# Altium schematic sheet [04] Connector.SchDoc
size A4
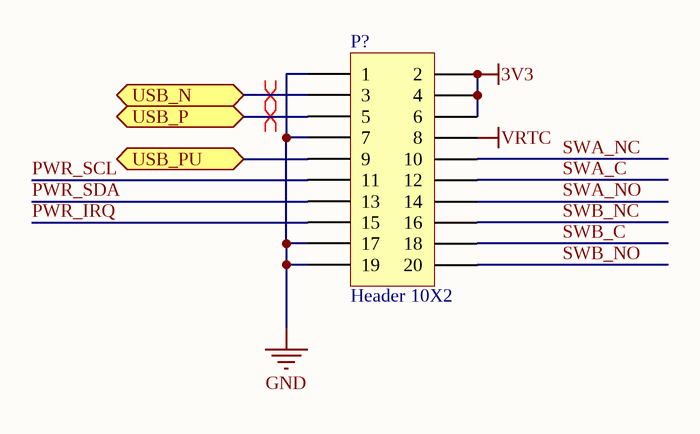
[diagram p0: [04] Connector.SchDoc]

## Parts
P?  Header 10X2  [SAMTEC_TSW-110-07-L-D-LL]

## Ports
USB_N (bidir), USB_P (bidir), USB_PU (bidir)

## Nets
3V3: P?.2 P?.4 P?.6
GND: P?.1 P?.7 P?.17 P?.19
VRTC: P?.8
PWR_IRQ: P?.15
PWR_SCL: P?.11
PWR_SDA: P?.13
SWA_C: P?.12
SWA_NC: P?.10
SWA_NO: P?.14
SWB_C: P?.18
SWB_NC: P?.16
SWB_NO: P?.20
USB_N: P?.3 ; port USB_N
USB_P: P?.5 ; port USB_P
USB_PU: P?.9 ; port USB_PU

## Layout directives
differential pair: USB_N, USB_P

## Library data of the parts
P? = Header 10X2: Header, 10-Pin, Dual row; LatestRevisionDate: 17-Jul-2002; LatestRevisionNote: Re-released for DXP Platform.; Publisher: Altium Limited